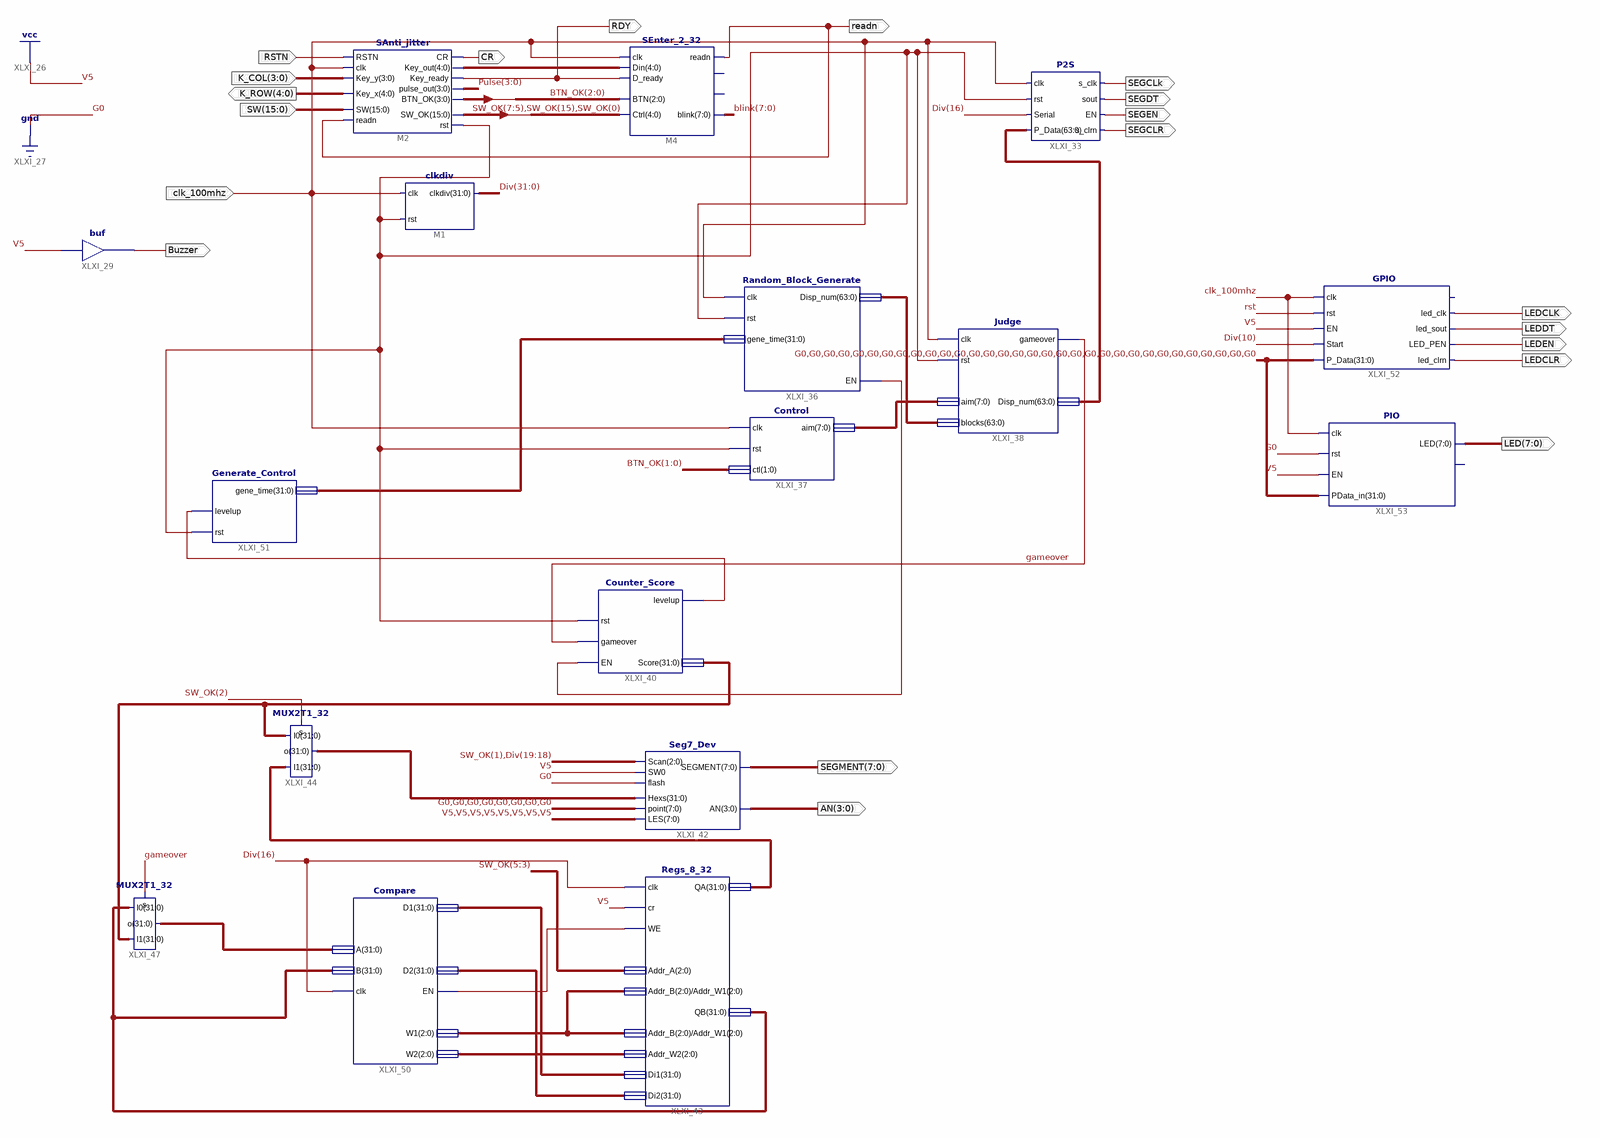
[diagram p0: schematic sheet 1]
// Xilinx ISE schematic Frame.sch (kintex7) as structural Verilog: 17 symbols, 20 ports
module Frame (
  input  RSTN,
  input  clk_100mhz,
  input  [3:0] K_COL,
  input  [15:0] SW,
  output CR,
  output RDY,
  output [4:0] K_ROW,
  output readn,
  output Buzzer,
  output SEGCLk,
  output SEGDT,
  output SEGEN,
  output SEGCLR,
  output [7:0] SEGMENT,
  output [3:0] AN,
  output LEDCLK,
  output LEDDT,
  output LEDEN,
  output LEDCLR,
  output [7:0] LED
);

  wire gameover, rst, XLXN_194, XLXN_196, XLXN_233;
  wire [2:0] XLXN_236, XLXN_237;
  wire [3:0] BTN_OK, Pulse;
  wire [4:0] XLXN_2;
  wire [7:0] blink, XLXN_189;
  wire [15:0] SW_OK;
  wire [31:0] Div, XLXN_200, XLXN_210, XLXN_212, XLXN_213, XLXN_216, XLXN_218, XLXN_231, XLXN_232;
  wire [63:0] blocks, Disp_num;

  SAnti_jitter M2 (
    .SW(SW), .readn(readn), .Key_y(K_COL), .Key_x(K_ROW), .RSTN(RSTN), .clk(clk_100mhz), .Key_out(XLXN_2),
    .Key_ready(RDY), .CR(CR), .rst(rst), .SW_OK(SW_OK), .pulse_out(Pulse), .BTN_OK(BTN_OK));
  clkdiv M1 (.rst(rst), .clkdiv(Div), .clk(clk_100mhz));
  buf XLXI_29 (Buzzer, 1'b1);
  SEnter_2_32 M4 (
    .readn(readn), .blink(blink), .Din(XLXN_2), .D_ready(RDY), .clk(clk_100mhz),
    .Ctrl({SW_OK[7:5], SW_OK[15], SW_OK[0]}), .BTN(BTN_OK[2:0]));  // open: Ai, Bi
  P2S XLXI_33 (
    .s_clrn(SEGCLR), .sout(SEGDT), .rst(rst), .EN(SEGEN), .Serial(Div[16]), .clk(clk_100mhz), .s_clk(SEGCLk),
    .P_Data(Disp_num));
  Random_Block_Generate XLXI_36 (.clk(clk_100mhz), .rst(rst), .gene_time(XLXN_200), .EN(XLXN_194), .Disp_num(blocks));
  Control XLXI_37 (.clk(clk_100mhz), .rst(rst), .ctl(BTN_OK[1:0]), .aim(XLXN_189));
  Judge XLXI_38 (
    .clk(clk_100mhz), .rst(rst), .aim(XLXN_189), .gameover(gameover), .Disp_num(Disp_num), .blocks(blocks));
  Counter_Score XLXI_40 (.rst(rst), .gameover(gameover), .EN(XLXN_194), .levelup(XLXN_196), .Score(XLXN_210));
  Seg7_Dev XLXI_42 (
    .LES({8{1'b1}}), .Scan({SW_OK[1], Div[19:18]}), .SEGMENT(SEGMENT), .AN(AN), .point({8{1'b0}}),
    .flash(1'b0), .SW0(1'b1), .Hexs(XLXN_213));
  Regs_8_32 XLXI_43 (
    .clk(Div[16]), .cr(1'b1), .WE(XLXN_233), .Addr_A(SW_OK[5:3]), .Addr_B(XLXN_236), .QA(XLXN_212),
    .QB(XLXN_216), .Addr_W1(XLXN_236), .Addr_W2(XLXN_237), .Di1(XLXN_231), .Di2(XLXN_232));
  MUX2T1_32 XLXI_44 (.o(XLXN_213), .I0(XLXN_210), .s(SW_OK[2]), .I1(XLXN_212));
  MUX2T1_32 XLXI_47 (.o(XLXN_218), .I0(XLXN_216), .s(gameover), .I1(XLXN_210));
  Compare XLXI_50 (
    .clk(Div[16]), .A(XLXN_218), .B(XLXN_216), .EN(XLXN_233), .D1(XLXN_231), .D2(XLXN_232), .W1(XLXN_236),
    .W2(XLXN_237));
  Generate_Control XLXI_51 (.levelup(XLXN_196), .gene_time(XLXN_200), .rst(rst));
  GPIO XLXI_52 (
    .clk(clk_100mhz), .P_Data({32{1'b0}}), .rst(rst), .EN(1'b1), .Start(Div[10]), .led_clrn(LEDCLR),
    .led_clk(LEDCLK), .led_sout(LEDDT), .LED_PEN(LEDEN));  // open: GPIOf0
  PIO XLXI_53 (.clk(clk_100mhz), .rst(1'b0), .EN(1'b1), .PData_in({32{1'b0}}), .LED(LED));  // open: GPIOf0
endmodule
